# Altium schematic sheet Current_Controller.SchDoc: Precision Current source
size A3; DocumentNumber: 10; SheetNumber: 10; SheetTotal: 20
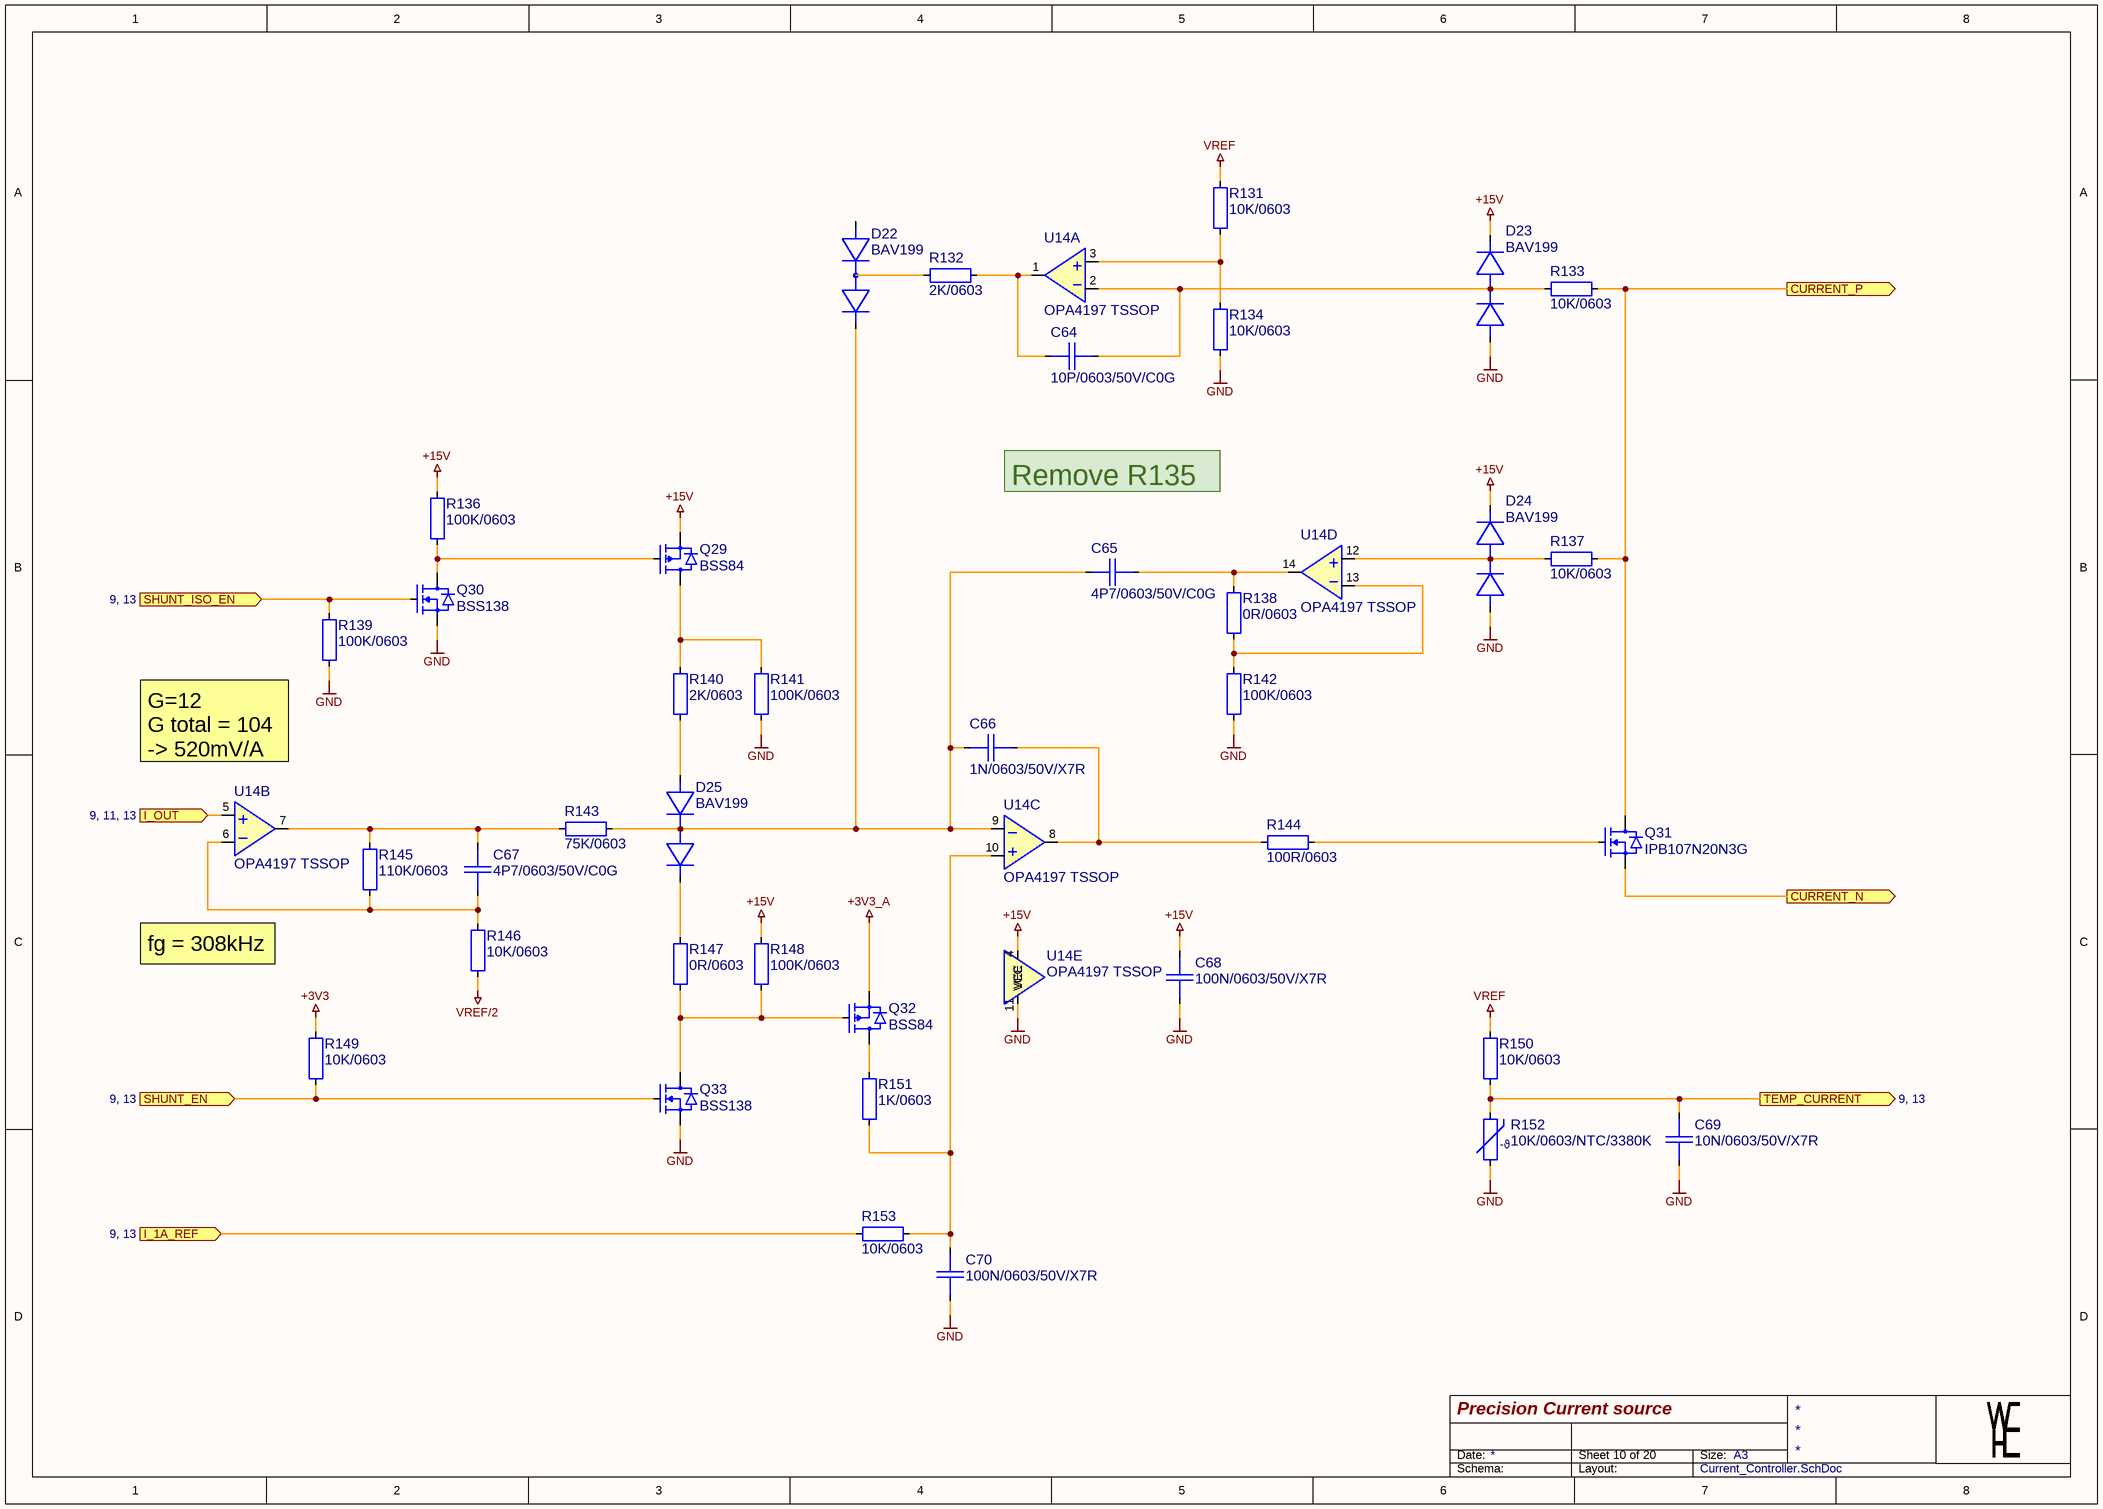
[diagram p0: Current_Controller.SchDoc]

## Parts
C64  10P/0603/50V/C0G  [CAP0603_C0G]
C65  4P7/0603/50V/C0G  [CAP0603_C0G]
C66  1N/0603/50V/X7R  [CAP0603_X7R]
C67  4P7/0603/50V/C0G  [CAP0603_C0G]
C68  100N/0603/50V/X7R  [CAP0603_X7R]
C69  10N/0603/50V/X7R  [CAP0603_X7R]
C70  100N/0603/50V/X7R  [CAP0603_X7R]
D22  BAV199  [SOT2395P280X125-3-SE]
D23  BAV199  [SOT2395P280X125-3-SE]
D24  BAV199  [SOT2395P280X125-3-SE]
D25  BAV199  [SOT2395P280X125-3-SE]
Q29  BSS84  [SOT2395P280X125-3-SE]
Q30  BSS138  [SOT2395P280X125-3-SE]
Q31  IPB107N20N3G  [TO254P1530X1035-3]
Q32  BSS84  [SOT2395P280X125-3-SE]
Q33  BSS138  [SOT2395P280X125-3-SE]
R131  10K/0603  [R0603-0.40-WW]
R132  2K/0603  [R0603-0.40-WW]
R133  10K/0603  [R0603-0.40-WW]
R134  10K/0603  [R0603-0.40-WW]
R136  100K/0603  [R0603-0.40-WW]
R137  10K/0603  [R0603-0.40-WW]
R138  0R/0603  [R0603-0.40-WW]
R139  100K/0603  [R0603-0.40-WW]
R140  2K/0603  [R0603-0.40-WW]
R141  100K/0603  [R0603-0.40-WW]
R142  100K/0603  [R0603-0.40-WW]
R143  75K/0603  [R0603-0.40-WW]
R144  100R/0603  [R0603-0.40-WW]
R145  110K/0603  [R0603-0.40-WW]
R146  10K/0603  [R0603-0.40-WW]
R147  0R/0603  [R0603-0.40-WW]
R148  100K/0603  [R0603-0.40-WW]
R149  10K/0603  [R0603-0.40-WW]
R150  10K/0603  [R0603-0.40-WW]
R151  1K/0603  [R0603-0.40-WW]
R152  10K/0603/NTC/3380K  [R0603-0.40-WW]
R153  10K/0603  [R0603-0.40-WW]
U14  OPA4197 TSSOP  [SOP065P640X120-14NW]  (parts A,B,C,D,E of 5)

## Ports
CURRENT_N (out), CURRENT_P (out), I_1A_REF (in, see 9, 13), I_OUT (in, see 9, 11, 13), SHUNT_EN (in, see 9, 13), SHUNT_ISO_EN (in, see 9, 13), TEMP_CURRENT (out, see 9, 13)

## Nets
+3V3: R149.1
+3V3_A: Q32.2(SOURCE)
+15V: C68.1 D23.2(K2) D24.2(K2) Q29.2(SOURCE) R136.1 R148.1 U14.4(VCC)
GND: C68.2 C69.2 C70.2 D23.1(A1) D24.1(A1) Q30.2(SOURCE) Q33.2(SOURCE) R134.2 R139.2 R141.2 R142.2 R152.2 U14.11(VEE)
VREF: R131.1 R150.1
VREF/2: R146.2
CURRENT_N: Q31.2(SOURCE) ; port CURRENT_N
CURRENT_P: Q31.3(DRAIN) R133.2 R137.2 ; port CURRENT_P
I_1A_REF: R153.1 ; port I_1A_REF
I_OUT: U14.5(IN+) ; port I_OUT
SHUNT_EN: Q33.1(GATE) R149.2 ; port SHUNT_EN
SHUNT_ISO_EN: Q30.1(GATE) R139.1 ; port SHUNT_ISO_EN
TEMP_CURRENT: C69.1 R150.2 R152.1 ; port TEMP_CURRENT
NetC64_1: C64.1 R132.1 U14.1(OUT)
NetC64_2: C64.2 D23.3(K1/A2) R133.1 U14.2(IN-)
NetC65_1: C65.1 C66.1 D22.2(K2) D25.3(K1/A2) R143.2 U14.9(IN-)
NetC65_2: C65.2 R138.1 U14.14(OUT)
NetC66_2: C66.2 R144.1 U14.8(OUT)
NetC67_1: C67.1 R143.1 R145.1 U14.7(OUT)
NetC67_2: C67.2 R145.2 R146.1 U14.6(IN-)
NetC70_1: C70.1 R151.2 R153.2 U14.10(IN+)
NetD22_3: D22.3(K1/A2) R132.2
NetD24_3: D24.3(K1/A2) R137.1 U14.12(IN+)
NetD25_1: D25.1(A1) R140.2
NetD25_2: D25.2(K2) R147.1
NetQ29_1: Q29.1(GATE) Q30.3(DRAIN) R136.2
NetQ29_3: Q29.3(DRAIN) R140.1 R141.1
NetQ31_1: Q31.1(GATE) R144.2
NetQ32_1: Q32.1(GATE) Q33.3(DRAIN) R147.2 R148.2
NetQ32_3: Q32.3(DRAIN) R151.1
NetR131_2: R131.2 R134.1 U14.3(IN+)
NetR138_2: R138.2 R142.1 U14.13(IN-)

Not connected (* = marked no-connect by the designer): D22 1(A1)

## Notes on the sheet
- Remove R135
- G=12
  G total = 104
  -> 520mV/A
- fg = 308kHz
- Date:
- Size:
- A3
- Schema:
- Layout:
- (in symbol 10K/0603/NTC/3380K) -ϑ

## Library data of the parts
C64 = 10P/0603/50V/C0G: CAP SM 0603 10pF 50V C0G; Manufacturer: GENERIC; Manufacturer 1: YAGEO; Manufacturer Part Number 1: CC0603JRNPO9BN100; Absolute Value: 1E-11; Eurocircuits GPN: GPC0603100-C0G; Part Number: 10P/0603/50V/C0G; Package: 0603; Value: 10pF; HelpURL: https://www.yageo.com/upload/media/product/productsearch/datasheet/mlcc/UPY-GP_NP0_16V-to-50V_18.pdf; Supplier 1: Digi-Key; Supplier Part Number 1: 311-1058-1-ND; Manufacturer 2: YAGEO; Manufacturer Part Number 2: CC0603KRNPO9BN100; Supplier 2: Digi-Key; Supplier Part Number 2: 311-4025-1-ND; Manufacturer Part Number 3: CL10C100JB8NNNC; Supplier 3: LCSC; Supplier Part Number 3: C1634
C65 C67 = 4P7/0603/50V/C0G: CAP SM 0603 4.7pF 50V C0G; Manufacturer: GENERIC; Manufacturer 1: YAGEO; Manufacturer Part Number 1: CC0603CRNPO9BN4R7; Absolute Value: 4.7E-12; Eurocircuits GPN: GPC06034R7-C0G; Part Number: 4P7/0603/50V/C0G; Package: 0603; Value: 4.7pF; HelpURL: https://www.yageo.com/upload/media/product/productsearch/datasheet/mlcc/UPY-GP_NP0_16V-to-50V_18.pdf; Supplier 1: Digi-Key; Supplier Part Number 1: 311-1740-1-ND; Manufacturer 2: YAGEO; Manufacturer Part Number 2: CC0603DRNPO9BN4R7; Supplier 2: Digi-Key; Supplier Part Number 2: 13-CC0603DRNPO9BN4R7CT-ND; Manufacturer Part Number 3: CGA0603C0G4R7C500JT; Supplier 3: LCSC; Supplier Part Number 3: C41361238
C66 = 1N/0603/50V/X7R: CAP SM 0603 1.0nF 50V X7R; Manufacturer: GENERIC; Manufacturer 1: YAGEO; Manufacturer Part Number 1: CC0603KPX7R9BB102; Absolute Value: 1E-9; Eurocircuits GPN: GPC0603102; Part Number: 1N/0603/50V/X7R; Package: 0603; Value: 1.0nF; HelpURL: https://www.yageo.com/upload/media/product/app/datasheet/mlcc/upy-gphc_x7r_6_3v-to-250v.pdf; Supplier 1: Digi-Key; Supplier Part Number 1: 13-CC0603KPX7R9BB102CT-ND; Manufacturer 2: YAGEO; Manufacturer Part Number 2: CC0603KRX7R9BB102; Supplier 2: Digi-Key; Supplier Part Number 2: 311-1080-1-ND; Manufacturer Part Number 3: CL10B102KB8NNNC; Supplier 3: LCSC; Supplier Part Number 3: C1588; JLC Type: Basic
C68 C70 = 100N/0603/50V/X7R: CAP SM 0603 100nF 50V X7R; Manufacturer: GENERIC; Manufacturer 1: YAGEO; Manufacturer Part Number 1: CC0603KPX7R9BB104; Absolute Value: 1E-7; Eurocircuits GPN: GPC0603104; Part Number: 100N/0603/50V/X7R; Package: 0603; Value: 100nF; HelpURL: https://www.yageo.com/upload/media/product/app/datasheet/mlcc/upy-gphc_x7r_6_3v-to-250v.pdf; Supplier 1: Digi-Key; Supplier Part Number 1: 311-3567-1-ND; Supplier 3: LCSC; Supplier Part Number 3: C14663; Manufacturer 2: YAGEO; Manufacturer Part Number 2: CC0603MRX7R9BB104; Supplier 2: Digi-Key; Supplier Part Number 2: 311-4110-1-ND; JLC Type: Basic; Manufacturer Part Number 3: CC0603KRX7R9BB104
C69 = 10N/0603/50V/X7R: CAP SM 0603 10nF 50V X7R; Manufacturer: GENERIC; Manufacturer 1: YAGEO; Manufacturer Part Number 1: CC0603KPX7R9BB103; Absolute Value: 1E-8; Eurocircuits GPN: GPC0603103; Part Number: 10N/0603/50V/X7R; Package: 0603; Value: 10nF; HelpURL: https://www.yageo.com/upload/media/product/app/datasheet/mlcc/upy-gphc_x7r_6_3v-to-250v.pdf; Supplier 1: Digi-Key; Supplier Part Number 1: 311-1572-1-ND; Manufacturer 2: YAGEO; Manufacturer Part Number 2: CC0603KRX7R9BB103; Supplier 2: Digi-Key; Supplier Part Number 2: 311-1085-1-ND; Manufacturer Part Number 3: CC0603KRX7R9BB103; Supplier 3: LCSC; Supplier Part Number 3: C100042
D22-D25 = BAV199: Silicon Low Leakage Diode 85V; Manufacturer: Infineon Technologies; Manufacturer Part Number 1: BAV199E6433HTMA1; Part Number: BAV199; Package: SOT23; Value: BAV199; Absolute Value: 85V; HelpURL: https://www.infineon.com/dgdl/bav199series.pdf?folderId=db3a30431400ef6801141c748874044e&fileId=db3a30431400ef6801141cba733104e5; Manufacturer 1: Infineon Technologies; Supplier 1: Digikey; Supplier Part Number 1: BAV199E6433HTMA1CT-ND; Manufacturer 3: LRC; Manufacturer Part Number 3: LBAV199LT1G; Supplier 3: LCSC; Supplier Part Number 3: C12740
Q29 Q32 = BSS84: 50V P-Channel MOSFET; Manufacturer: GENERIC; Manufacturer 1: Good-Ark Semiconductor; Part Number: BSS84; Package: SOT23; HelpURL: https://goodarksemi.com/docs/datasheets/mosfets/BSS84.pdf; Manufacturer Part Number 1: BSS84; Supplier 1: Digi-Key; Supplier Part Number 1: 4786-BSS84CT-ND; Manufacturer 3: Jiangsu Changjing Electronics Technology Co., Ltd.; Manufacturer Part Number 3: BSS84; Supplier 3: LCSC; Supplier Part Number 3: C114481; JLC Type: Extended; Manufacturer 2: LRC; Manufacturer Part Number 2: LBSS84LT1G; Supplier 2: LCSC; Supplier Part Number 2: C8492
Q30 Q33 = BSS138: N-Kanal 50 V 220mA (Ta) 350mW (Ta) Oberflächenmontage SOT-23; Manufacturer: GENERIC; Manufacturer 1: ANBON SEMICONDUCTOR (INT'L) LIMITED; Part Number: BSS138; Package: SOT23; HelpURL: https://mm.digikey.com/Volume0/opasdata/d220001/medias/docus/3037/BSS138.pdf; Manufacturer Part Number 1: BSS138; Supplier 1: Digi-Key; Supplier Part Number 1: 4530-BSS138CT-ND; Manufacturer 3: FOSAN; Manufacturer Part Number 3: BSS138; Supplier 3: LCSC; Supplier Part Number 3: C2926186; JLC Type: Extended; Manufacturer 2: FOSAN; Manufacturer Part Number 2: BSS138; Supplier 2: LCSC; Supplier Part Number 2: C2926186
Q31 = IPB107N20N3G: 200V 88A 300W 10.7mΩ@10V,88A 4V 1 N-channel TO-263-3 MOSFETs ROHS; Manufacturer: Infineon Technologies; Manufacturer Part Number 1: IPB107N20N3GATMA1CT-ND; Part Number: IPB107N20N3G; Package: TO-263; HelpURL: https://www.infineon.com/dgdl/IPP_I_110N20N3+G_IPB107N20N3+G+Rev2.2.pdf?folderId=db3a3043163797a6011637d4bae7003b&fileId=db3a3043243b5f170124968e7d1f18e7; Manufacturer 1: Infineon Technologies; Supplier 1: Digi-Key; Supplier Part Number 1: IPB107N20N3GATMA1; Manufacturer 3: Infineon Technologies; Manufacturer Part Number 3: IPB107N20N3G; Supplier 3: LCSC; Supplier Part Number 3: C444895
R131 R133 R134 R137 R146 R149 R150 R153 = 10K/0603: RES SM 0603 10K; Manufacturer: GENERIC; Manufacturer 1: YAGEO; Manufacturer Part Number 1: RC0603FR-1310KL; Absolute Value: 10000; Eurocircuits GPN: GPR060310K; Part Number: 10K/0603; Package: 0603; Value: 10K; HelpURL: https://www.yageogroup.com/content/datasheet/asset/file/PYU-RC_GROUP_51_ROHS_L; Supplier 1: Digi-Key; Supplier Part Number 1: 13-RC0603FR-1310KLCT-ND; Manufacturer 2: YAGEO; Manufacturer Part Number 2: RC0603FR-1010KL; Supplier 2: Digi-Key; Supplier Part Number 2: 13-RC0603FR-1010KLCT-ND; Manufacturer 3: UNI-ROYAL(Uniroyal Elec); Manufacturer Part Number 3: 0603WAF1002T5E; Supplier 3: LCSC; Supplier Part Number 3: C25804; JLC Type: Basic
R132 R140 = 2K/0603: RES SM 0603 2K; Manufacturer: GENERIC; Manufacturer 1: YAGEO; Manufacturer Part Number 1: RC0603FR-132KL; Absolute Value: 2000; Eurocircuits GPN: GPR06032K; Part Number: 2K/0603; Package: 0603; Value: 2K; HelpURL: https://www.yageogroup.com/content/datasheet/asset/file/PYU-RC_GROUP_51_ROHS_L; Supplier 1: Digi-Key; Supplier Part Number 1: 13-RC0603FR-132KLCT-ND; Manufacturer 2: YAGEO; Manufacturer Part Number 2: RC0603FR-102KL; Supplier 2: Digi-Key; Supplier Part Number 2: 13-RC0603FR-102KLCT-ND; Manufacturer 3: UNI-ROYAL(Uniroyal Elec); Manufacturer Part Number 3: 0603WAF2001T5E; Supplier 3: LCSC; Supplier Part Number 3: C22975; JLC Type: Basic
R136 R139 R141 R142 R148 = 100K/0603: RES SM 0603 100K; Manufacturer: GENERIC; Manufacturer 1: YAGEO; Manufacturer Part Number 1: RC0603FR-13100KL; Absolute Value: 100000; Eurocircuits GPN: GPR0603100K; Part Number: 100K/0603; Package: 0603; Value: 100K; HelpURL: https://www.yageogroup.com/content/datasheet/asset/file/PYU-RC_GROUP_51_ROHS_L; Supplier 1: Digi-Key; Supplier Part Number 1: 13-RC0603FR-13100KLCT-ND; Manufacturer 2: YAGEO; Manufacturer Part Number 2: RC0603FR-10100KL; Supplier 2: Digi-Key; Supplier Part Number 2: 13-RC0603FR-10100KLCT-ND; Manufacturer 3: UNI-ROYAL(Uniroyal Elec); Manufacturer Part Number 3: 0603WAF1003T5E; Supplier 3: LCSC; Supplier Part Number 3: C25803; JLC Type: Basic
R138 R147 = 0R/0603: RES SM 0603 0R; Manufacturer: GENERIC; Manufacturer 1: YAGEO; Manufacturer Part Number 1: RC0603FR-070RL; Absolute Value: 0; Eurocircuits GPN: GPR06030R; Part Number: 0R/0603; Package: 0603; Value: 0R; HelpURL: https://www.yageogroup.com/content/datasheet/asset/file/PYU-RC_GROUP_51_ROHS_L; Supplier 1: Digi-Key; Supplier Part Number 1: 311-0.0HRCT-ND; Manufacturer 2: YAGEO; Manufacturer Part Number 2: RC0603FR-130RL; Supplier 2: Digi-Key; Supplier Part Number 2: 13-RC0603FR-130RLCT-ND; Manufacturer 3: UNI-ROYAL(Uniroyal Elec); Manufacturer Part Number 3: 0603WAF0000T5E; Supplier 3: LCSC; Supplier Part Number 3: C21189; JLC Type: Basic
R143 = 75K/0603: RES SM 0603 75K; Manufacturer: GENERIC; Manufacturer 1: YAGEO; Manufacturer Part Number 1: RC0603FR-1375KL; Absolute Value: 75000; Eurocircuits GPN: GPR060375K; Part Number: 75K/0603; Package: 0603; Value: 75K; HelpURL: https://www.yageogroup.com/content/datasheet/asset/file/PYU-RC_GROUP_51_ROHS_L; Supplier 1: Digi-Key; Supplier Part Number 1: 13-RC0603FR-1375KLCT-ND; Manufacturer 2: YAGEO; Manufacturer Part Number 2: RC0603FR-1075KL; Supplier 2: Digi-Key; Supplier Part Number 2: 13-RC0603FR-1075KLCT-ND; Manufacturer 3: UNI-ROYAL(Uniroyal Elec); Manufacturer Part Number 3: 0603WAF7502T5E; Supplier 3: LCSC; Supplier Part Number 3: C23242; JLC Type: Basic
R144 = 100R/0603: RES SM 0603 100R; Manufacturer: GENERIC; Manufacturer 1: YAGEO; Manufacturer Part Number 1: RC0603FR-13100RL; Absolute Value: 100; Eurocircuits GPN: GPR0603100R; Part Number: 100R/0603; Package: 0603; Value: 100R; HelpURL: https://www.yageogroup.com/content/datasheet/asset/file/PYU-RC_GROUP_51_ROHS_L; Supplier 1: Digi-Key; Supplier Part Number 1: 13-RC0603FR-13100RLCT-ND; Manufacturer 2: YAGEO; Manufacturer Part Number 2: RC0603FR-10100RL; Supplier 2: Digi-Key; Supplier Part Number 2: 13-RC0603FR-10100RLCT-ND; Manufacturer 3: UNI-ROYAL(Uniroyal Elec); Manufacturer Part Number 3: 0603WAF1000T5E; Supplier 3: LCSC; Supplier Part Number 3: C22775
R145 = 110K/0603: RES SM 0603 110K; Manufacturer: GENERIC; Manufacturer 1: YAGEO; Manufacturer Part Number 1: RC0603FR-13110KL; Absolute Value: 110000; Eurocircuits GPN: GPR0603110K; Part Number: 110K/0603; Package: 0603; Value: 110K; HelpURL: https://www.yageogroup.com/content/datasheet/asset/file/PYU-RC_GROUP_51_ROHS_L; Supplier 1: Digi-Key; Supplier Part Number 1: 13-RC0603FR-13110KLCT-ND; Manufacturer 2: YAGEO; Manufacturer Part Number 2: RC0603FR-07110KL; Supplier 2: Digi-Key; Supplier Part Number 2: 311-110KHRCT-ND; JLC Type: Extended; Manufacturer 3: UNI-ROYAL(Uniroyal Elec); Manufacturer Part Number 3: 0603WAF1103T5E; Supplier 3: LCSC; Supplier Part Number 3: C25805
R151 = 1K/0603: RES SM 0603 1K; Manufacturer: GENERIC; Manufacturer 1: YAGEO; Manufacturer Part Number 1: RC0603FR-131KL; Absolute Value: 1000; Eurocircuits GPN: GPR06031K; Part Number: 1K/0603; Package: 0603; Value: 1K; HelpURL: https://www.yageogroup.com/content/datasheet/asset/file/PYU-RC_GROUP_51_ROHS_L; Supplier 1: Digi-Key; Supplier Part Number 1: 13-RC0603FR-131KLCT-ND; Manufacturer 2: YAGEO; Manufacturer Part Number 2: RC0603FR-101KL; Supplier 2: Digi-Key; Supplier Part Number 2: 13-RC0603FR-101KLCT-ND; Manufacturer 3: UNI-ROYAL(Uniroyal Elec); Manufacturer Part Number 3: 0603WAF1001T5E; Supplier 3: LCSC; Supplier Part Number 3: C21190; JLC Type: Basic
R152 = 10K/0603/NTC/3380K: RES NTC SM 0603 10K; Manufacturer: GENERIC; Manufacturer 1: Murata; Manufacturer Part Number 1: NCU18XH103E60RB; Absolute Value: 10000; Eurocircuits GPN: GPR060310K; Part Number: 10K/0603/NTC/3380K; Package: 0603; Value: 10K; HelpURL: https://www.murata.com/en-us/api/pdfdownloadapi?cate=luNTCforTempeSenso&partno=NCU18XH103E60RB; Supplier 1: Digi-Key; Supplier Part Number 1: 490-18164-1-ND; Manufacturer 3: Sunlord; Manufacturer Part Number 3: SDNT1608X103F3380FTF; Supplier 3: LCSC; Supplier Part Number 3: C316397; JLC Type: Extended
U14 = OPA4197 TSSOP: OPA4197 36-V, Precision, Rail-to-Rail Input/Output, Low Offset Voltage, Operational Amplifiers; Manufacturer: Texas Instruments; Manufacturer Part Number 1: OPA4197IPWR; Part Number: OPA4197 TSSOP; Package: TSSOP-14; HelpURL: https://www.ti.com/lit/ds/symlink/opa197.pdf; Manufacturer 1: Texas Instruments; Supplier 1: Digi-Key; Supplier Part Number 1: 296-45060-1-ND; Manufacturer 3: Texas Instruments; Manufacturer Part Number 3: OPA4197IPWR; Supplier 3: LCSC; Supplier Part Number 3: C2057327; Manufacturer 2: Texas Instruments; Manufacturer Part Number 2: OPA4197QPWRQ1; Supplier 2: Digi-Key; Supplier Part Number 2: 296-OPA4197QPWRQ1CT-ND